# EAGLE design board (EAGLE 7.4.0)
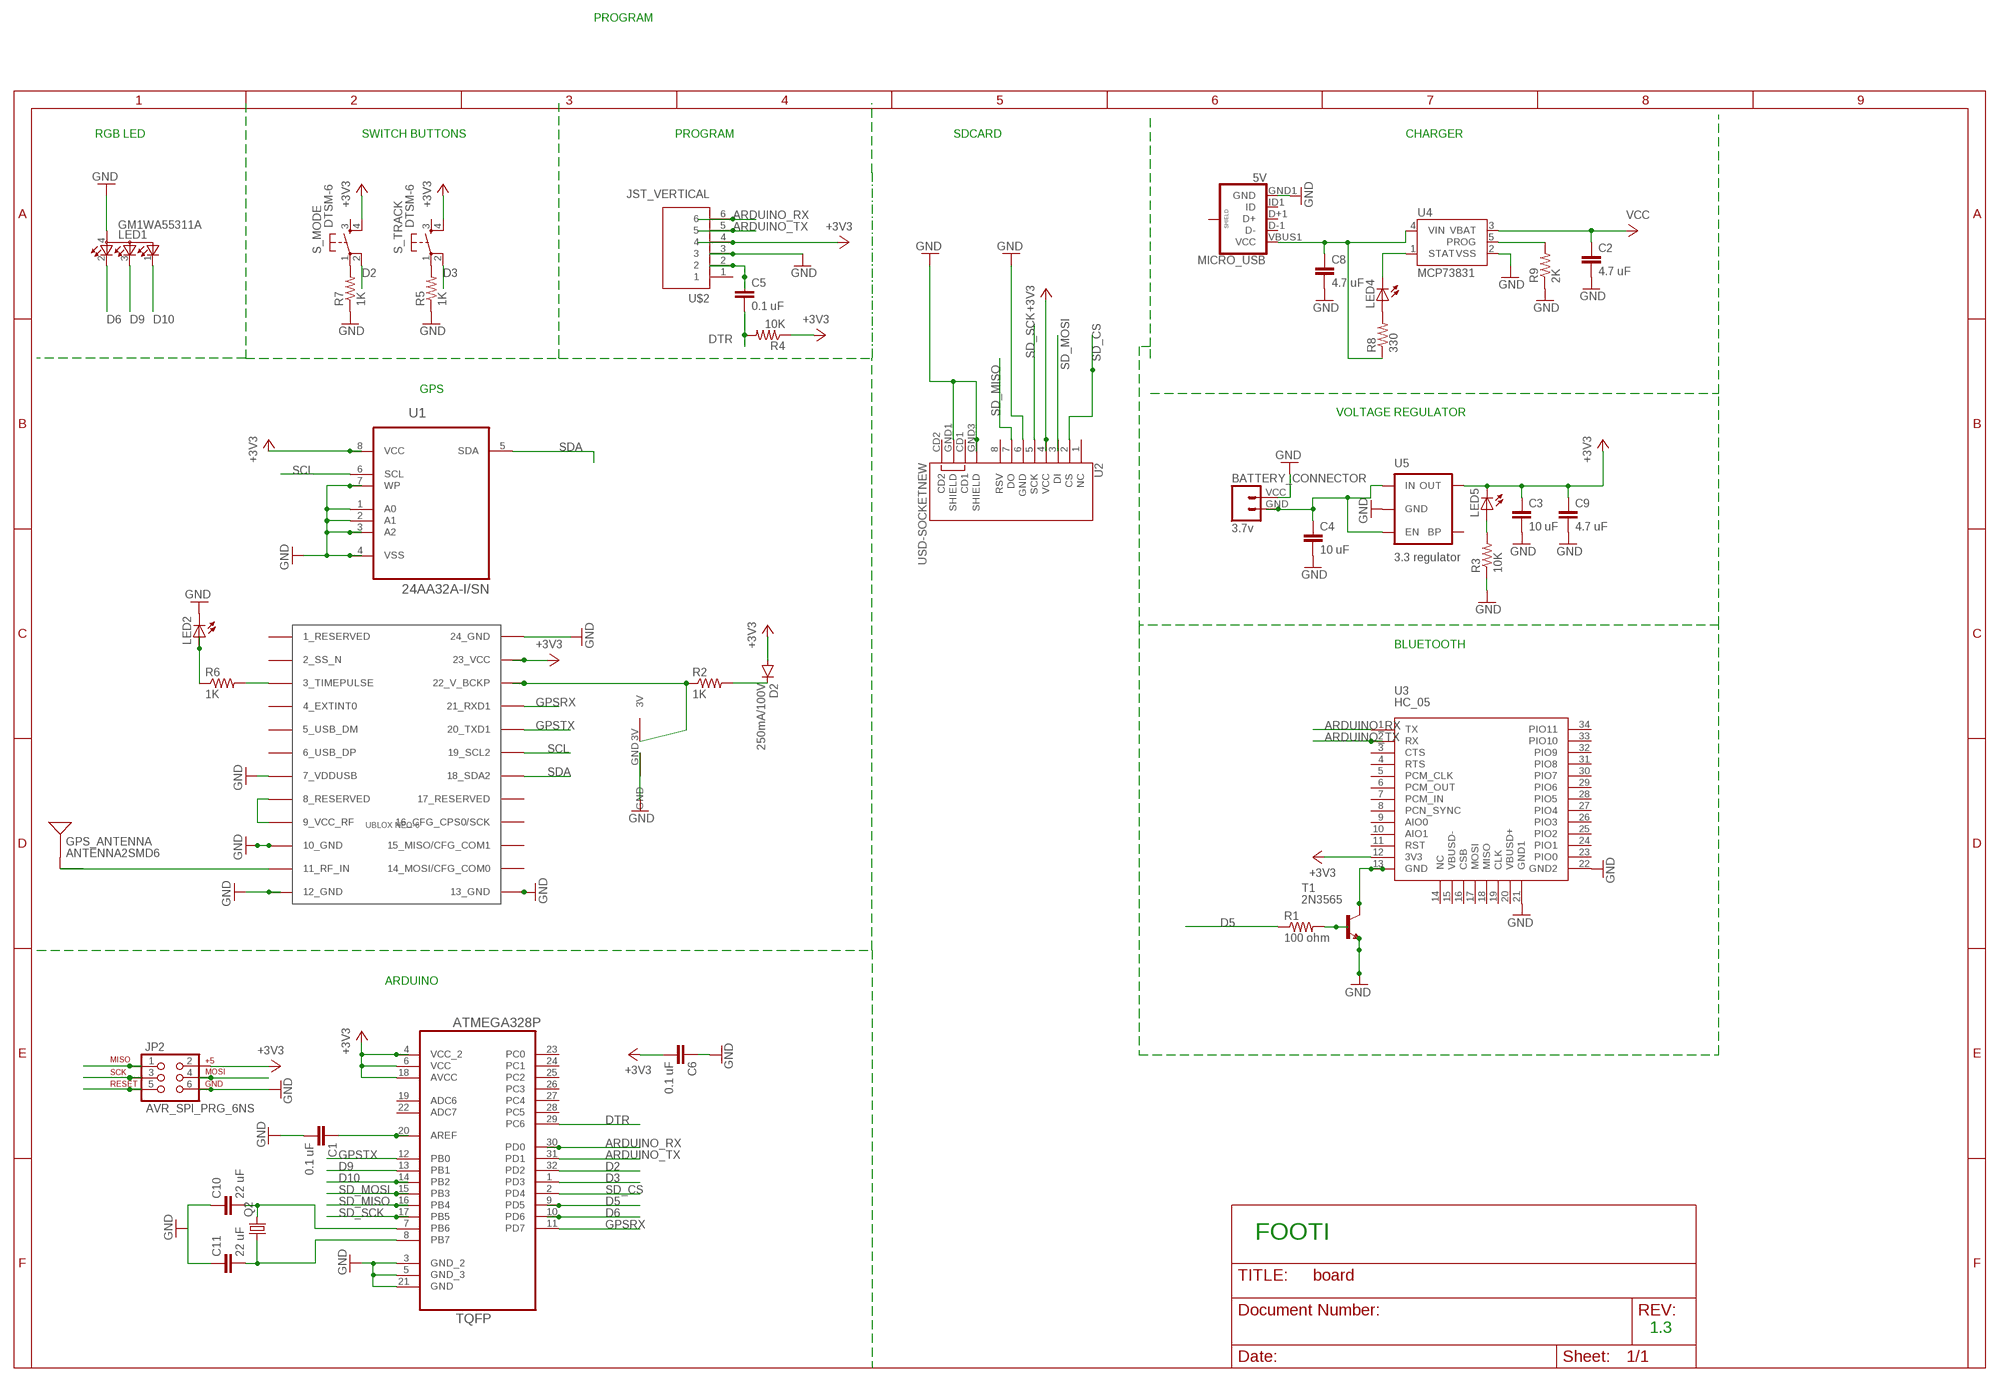
[diagram p0: schematic, sheet 1]

## Parts
BATTERY_CONNECTOR  3.7v  M024UCON-15767  [JST-2-SMD-VERT]
C1  0.1 uF  CAP1206  [1206]
C2  4.7 uF  CAP1206  [1206]
C3  10 uF  CAP1206  [1206]
C4  10 uF  CAP1206  [1206]
C5  0.1 uF  CAP1206  [1206]
C6  0.1 uF  CAP1206  [1206]
C8  4.7 uF  CAP1206  [1206]
C9  4.7 uF  CAP1206  [1206]
C10  22 uF  CAP1206  [1206]
C11  22 uF  CAP1206  [1206]
D2  250mA/100V  DIODEBAS16  [SOD-323]
GPS_ANTENNA  ANTENNA2SMD6  [ANTENNA-CHIP6]
JP2  AVR_SPI_PRG_6NS  [2X3-NS]
LED1  GM1WA55311A  [GM1WA55311A]
LED2  LED_E  [LED_1206]
LED4  LED_E  [LED_1206]
LED5  LED_E  [LED_1206]
MICRO_USB  5V  USB_MICROB_PLUGCONN-11752  [USB-B-MICRO-SMD_V03]
Q2  CRYSTALCTS406  [CTS406]
R1  100 ohm  RESISTOR1206  [1206]
R2  1K  RESISTOR1206  [1206]
R3  10K  RESISTOR1206  [1206]
R4  10K  RESISTOR1206  [1206]
R5  1K  RESISTOR1206  [1206]
R6  1K  RESISTOR1206  [1206]
R7  1K  RESISTOR1206  [1206]
R8  330  RESISTOR1206  [1206]
R9  2K  RESISTOR1206  [1206]
S_MODE  DTSM-6  [DTSM-6]
S_TRACK  DTSM-6  [DTSM-6]
T1  2N3565  [TO92]
U1  24AA32A-I/SN  [SOIC127P600X175-8N]
U2  USD-SOCKETNEW  [MICRO-SD-SOCKET-PP]
U3  HC_05  [BLUETOOTH_SMD]
U4  MCP73831  [SOT23-5]
U5  3.3 regulator  MIC52053.3V  [SOT23-5]
U6  ATMEGA328P-AU  [QFP80P900X900X120-32N]
U$1  UBLOX_NEO-6  [UBLOX_NEO-6P]
U$2  JST_VERTICAL  [JST-6-SMD-VERT-1.0MM]
U$4  VL1220/HFN  VL1220  [VL1220]

## Nets
+3V3: C3.1 C6.2 C9.1 D2.A JP2.2 LED5.C R4.1 S_MODE.4 S_TRACK.4 U1.8(VCC) U2.4(VCC) U3.12(3V3) U5.5(OUT) U6.4(VCC_2) U6.6(VCC) U6.18(AVCC) U$1.23_VCC U$2.4
ARDUINO_RX: U3.1(TX) U6.30(PD0) U$2.6
ARDUINO_TX: U3.2(RX) U6.31(PD1) U$2.5
D2: S_MODE.2 U6.32(PD2)
D3: S_TRACK.2 U6.1(PD3)
D5: R1.1 U6.9(PD5)
D6: LED1.2(CRED) U6.10(PD6)
D9: LED1.3(CBLUE) U6.13(PB1)
D10: LED1.1(CGREEN) U6.14(PB2)
DTR: C5.2 JP2.5 R4.2 U6.29(PC6)
GND [ground]: BATTERY_CONNECTOR.VCC C1.2 C2.2 C3.2 C4.2 C6.1 C8.2 C9.2 C10.1 C11.1 JP2.6 LED1.4(A) LED2.C MICRO_USB.GND1(GND) R3.1 R5.1 R7.1 R9.1 T1.3(E) U1.1(A0) U1.2(A1) U1.3(A2) U1.4(VSS) U1.7(WP) U2.6(GND) U2.GND1(SHIELD) U2.GND3(SHIELD) U3.21(GND1) U3.22(GND2) U4.2(VSS) U5.2(GND) U6.3(GND_2) U6.5(GND_3) U6.21(GND) U$1.7_VDDUSB U$1.10_GND U$1.12_GND U$1.13_GND U$1.24_GND U$2.3 U$4.GND
GPSRX: U6.11(PD7) U$1.21_RXD1
GPSTX: U6.12(PB0) U$1.20_TXD1
N$1: D2.C R2.2
N$2: C8.1 MICRO_USB.VBUS1(VCC) R8.1 U4.4(VIN)
N$3: R6.2 U$1.3_TIMEPULSE
N$4: LED2.A R6.1
N$5: U$1.8_RESERVED U$1.9_VCC_RF
N$6: R2.1 U$1.22_V_BCKP U$4.3V
N$7: GPS_ANTENNA.1(SIGNAL) U$1.11_RF_IN
N$8: LED4.A R8.2
N$9: R7.2 S_MODE.1
N$10: R5.2 S_TRACK.1
N$11: LED4.C U4.1(STAT)
N$13: C5.1 U$2.2
N$15: R9.2 U4.5(PROG)
N$16: LED5.A R3.2
N$19: R1.2 T1.2(B)
N$20: T1.1(C) U3.13(GND)
N$22: C1.1 U6.20(AREF)
N$27: C11.2 Q2.1 U6.8(PB7)
N$29: C10.2 Q2.3 U6.7(PB6)
SCL: U1.6(SCL) U$1.19_SCL2
SD_CS: U2.2(CS) U6.2(PD4)
SD_MISO: JP2.1 U2.7(DO) U6.16(PB4)
SD_MOSI: JP2.4 U2.3(DI) U6.15(PB3)
SD_SCK: JP2.3 U2.5(SCK) U6.17(PB5)
SDA: U1.5(SDA) U$1.18_SDA2
VCC: BATTERY_CONNECTOR.GND C2.1 C4.1 U4.3(VBAT) U5.1(IN) U5.3(EN)
Unconnected: MICRO_USB.D+1(D+) MICRO_USB.D-1(D-) MICRO_USB.ID1(ID) MICRO_USB.SHIELD1(SHIELD) MICRO_USB.SHIELD2(SHIELD) MICRO_USB.SHIELD3(SHIELD) S_MODE.3 S_TRACK.3 U2.1(NC) U2.8(RSV) U2.CD1 U2.CD2 U3.3(CTS) U3.4(RTS) U3.5(PCM_CLK) U3.6(PCM_OUT) U3.7(PCM_IN) U3.8(PCN_SYNC) U3.9(AIO0) U3.10(AIO1) U3.11(RST) U3.14(NC) U3.15(VBUSD-) U3.16(CSB) U3.17(MOSI) U3.18(MISO) U3.19(CLK) U3.20(VBUSD+) U3.23(PIO0) U3.24(PIO1) U3.25(PIO2) U3.26(PIO3) U3.27(PIO4) U3.28(PIO5) U3.29(PIO6) U3.30(PIO7) U3.31(PIO8) U3.32(PIO9) U3.33(PIO10) U3.34(PIO11) U5.4(BP) U6.19(ADC6) U6.22(ADC7) U6.23(PC0) U6.24(PC1) U6.25(PC2) U6.26(PC3) U6.27(PC4) U6.28(PC5) U$1.1_RESERVED U$1.2_SS_N U$1.4_EXTINT0 U$1.5_USB_DM U$1.6_USB_DP U$1.14_MOSI/CFG_COM0 U$1.15_MISO/CFG_COM1 U$1.16_CFG_CPS0/SCK U$1.17_RESERVED U$2.1

## Notes on the sheet
- PROGRAM
- RGB LED | SWITCH BUTTONS | PROGRAM | SDCARD | CHARGER
- GPS
- VOLTAGE REGULATOR
- BLUETOOTH
- ARDUINO
- FOOTI
- 1.3

## Library data of the parts
BATTERY_CONNECTOR = SparkFun-Connectors:M02: Standard 2-pin 0.1" header. Use with - straight break away headers ( PRT-00116) - right angle break away headers (PRT-00553) - swiss pins (PRT-00743) - machine pins (PRT-00117) - female headers (PRT-00115) Molex polarized connector foot print use with: PRT-08233 with associated crimp pins and housings. 2.54_SCREWTERM for use with PRT-10571. 3.5mm Screw Terminal footprints for PRT-08084 5mm Screw Terminal footprints for use with PRT-08432
C1-C6 C8-C11 = SparkFun-Capacitors:CAP: Capacitor Standard 0603 ceramic capacitor, and 0.1" leaded capacitor.
D2 = SparkFun-DiscreteSemi:DIODE: Diode These are standard reverse protection diodes and small signal diodes. SMA package can handle up to about 1A. SOD-323 can handle about 200mA. What the SOD-323 package when ordering, there are some mfgs out there that are 5-pin packages.; PROD_ID: DIO-09646
GPS_ANTENNA = SparkFun-RF:ANTENNA2: Chip antenna Single endded antenna. Common with smaller chip antennas. CHIP4 package is the GPS Chip Antenna SKU: GPS-08418. CHIP5 package is 2.4GHz chip antenna SKU: WRL-00144.
JP2 = SparkFun-Connectors:AVR_SPI_PRG_6: AVR ISP 6 Pin This is the reduced ISP connector for AVR programming. Common on Arduino. This footprint will take up less PCB space and can be used with a 10-pin to 6-pin adapter such as SKU: BOB-08508 **Special note about "TEST_POINT" package. The stop mask is on the top side, so if you want your programming test points to be on the bottom of your board, make sure to place this package on the bottom side of the board. This also ensure that the orientation to program from the bottom side will be correct.
LED1 = led:GM1WA55311A: Chip LED RGB Source: http://document.sharpsma.com/files/GM1WA55311A_SS.pdf
LED2 LED4 LED5 = eagle-ltspice:LED_E: LED Source: http://www.osram.convergy.de Source: www.luxeon.com Source: www.kingbright.com; SPICEMODEL: NONE; SPICEPREFIX: D; SPICETYPE: diode
MICRO_USB = SparkFun-Connectors:USB_MICROB_PLUG: USB Micro-B connectors Some male, some female. Watch your step!; PROD_ID: CONN-11752
Q2 = crystal:CRYSTAL: CRYSTAL; OC_FARNELL: unknown; OC_NEWARK: unknown
R1-R9 = SparkFun-Passives:RESISTOR: Resistor Basic schematic elements and footprints for 0603, 1206, and PTH resistors.
S_MODE S_TRACK = switch-tact:DTSM-6; OC_FARNELL: unknown
T1 = transistor:2N3565: NPN TRANSISTOR
U1 = footie:24AA32A-I/SN: IC EEPROM 32KBIT 400KHZ ,SOIC-8; MPN: 24AA32A-I/SN; OC_FARNELL: 1617659; OC_NEWARK: 83C5815; PACKAGE: SOIC-8; SUPPLIER: Microchip
U2 = SparkFun-Connectors:USD-SOCKET: microSD Socket Push-push type uSD socket. Schematic element and footprint production proven. Spark Fun Electronics SKU : PRT-00127. tDoc lines correctly indicate media card edge positions when inserting (unlocked, locked, depressed). NOTE: CD1 and CD2 are connected internally; PROD_ID: CONN-07820
U3 = SerialPortBluetooth:HC_05
U4 = SparkFun-PowerIC:MCP73831: Miniature single cell, fully integrated Li-Ion, Li-polymer charge management controller http://ww1.microchip.com/downloads/en/DeviceDoc/20001984g.pdf IC-09995; PROD_ID: IC-09995
U5 = SparkFun-PowerIC:MIC5205: MIC5205 150mA vreg 3.3V - VREG-00822 5V - VREG-00823; PROD_ID: VREG-00822
U6 = Ava:ATMEGA328P-AU; DESCRIPTION: 8-bit Microcontroller with In-System Programmable Flash; MPN: ATMEGA328P-AU; OC_FARNELL: 1715486; OC_NEWARK: 14R4631; PACKAGE: TQFP-32; SUPPLIER: Atmel
U$1 = Ava:UBLOX_NEO-6: UBLOX NEO-6 GPS MODULE Author Anthony Stirk / http://ava.upuaut.net http://www.u-blox.com/images/downloads/Product_Docs/LEA-6_NEO-6_MAX_HardwareIntegrationManual_%28GPS.G6-HW-09007%29.pdf http://www.u-blox.com/images/downloads/Product_Docs/NEO-6_DataSheet_%28GPS.G6-HW-09005%29.pdf
U$2 = SparkFun-Connectors:JST_VERTICAL; PROD_ID: CONN-08249
U$4 = footie:VL1220

## Net classes
1 ground: width 0.508 mm

## Board
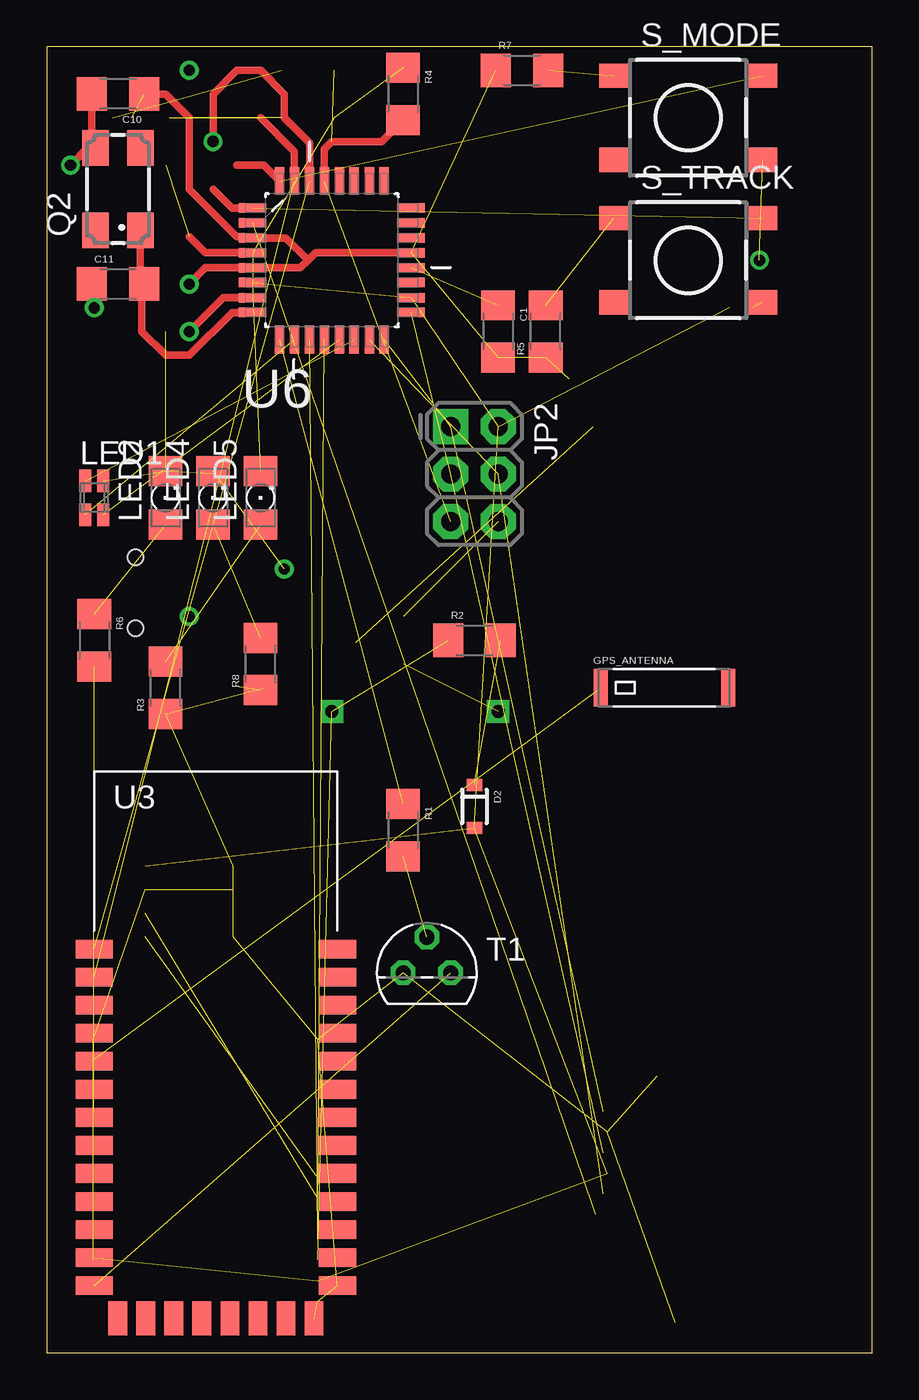
[diagram p1: board, top side]
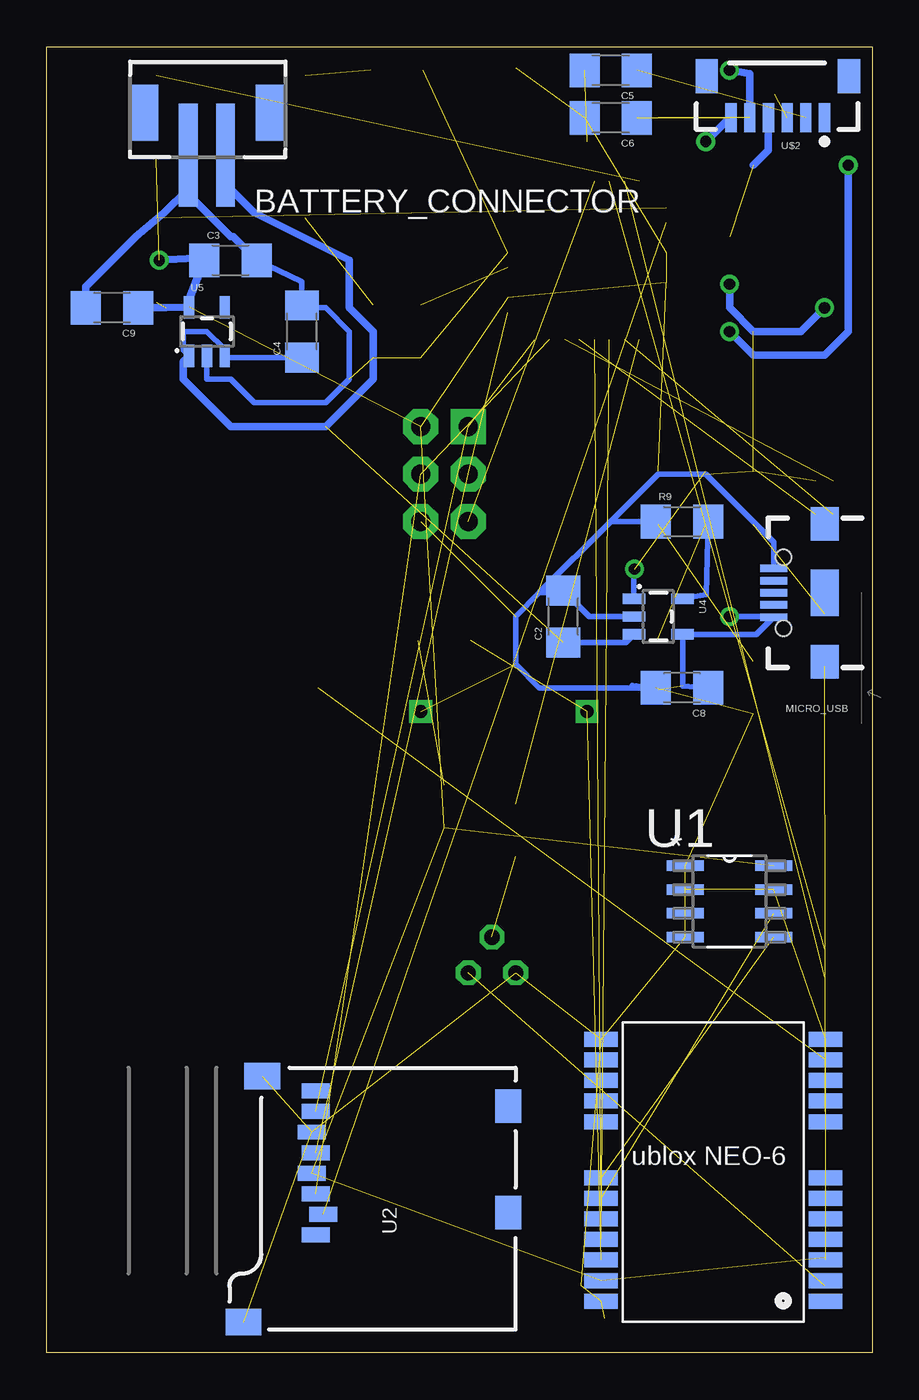
[diagram p2: board, bottom side, seen from below]

Size 44.12 x 69.84 mm. Coordinates in mm from the lower left corner, seen from the top.
Outline: 0,0 44.12,0 44.12,69.84 0,69.84 0,0
Copper layers (1*16): Top 0.035mm / dielectric 1.5mm / Bottom 0.035mm
Design rules "default": minimum track width 10mil, minimum drill 24mil, track to track 8mil, track to pad 8mil, pad to pad 8mil, via to via 8mil, smd to smd 8mil, copper to edge 40mil, drill to drill 8mil, minimum pad ring 10mil, minimum via ring 8mil, stop-mask expansion 4mil, vias tented up to drill 0mil, thermal gap 10mil

### Footprints (pad centres in the part's own frame; a part is rotated, then mirrored left to right if it is on the bottom)
JST-2-SMD-VERT = smd 1 x 5.5: GND 1,-2; VCC -1,-2 | smd 1.6 x 3: P$1 -3.4,0.27; P$2 3.4,0.27
1206 = smd 1.6 x 1.8: 1 -1.4,0; 2 1.4,0
SOD-323 = smd 0.63 x 0.83: A 1.15,0; C -1.15,0
ANTENNA-CHIP6 = smd 0.75 x 2: 1 -3.4,0; NC 3.4,0
2X3-NS = drill 1.016 pad 1.88 square: 1 -2.54,-1.27 | drill 1.016 pad 1.88 octagon: 2 -2.54,1.27; 3 0,-1.27; 4 0,1.27; 5 2.54,-1.27; 6 2.54,1.27
GM1WA55311A = smd 0.65 x 1.2: 1 -0.475,0.9; 2 -0.475,-0.9; 3 0.475,-0.9; 4 0.475,0.9
LED_1206 = smd 1.6 x 1.803: A -1.422,0; C 1.422,0
USB-B-MICRO-SMD_V03 = smd 1.45 x 0.4: D+1 2.725,0; D-1 2.725,0.65; GND1 2.725,-1.3; ID1 2.725,-0.65; VBUS1 2.725,1.3 | smd 1.5 x 1.8: SHIELD1 0,3.685; SHIELD2 0,-3.685 | smd 1.5 x 2.5: SHIELD3 0,0 | hole 0.85: 2.2,1.9; 2.2,-1.9
CTS406 = smd 1.9 x 1.4: 1 -2.2,-1.2; 2 2.2,-1.2; 3 2.2,1.2; 4 -2.2,1.2
DTSM-6 = smd 1.55 x 1.3: 1 -3.975,2.25; 2 3.975,2.25; 3 -3.975,-2.25; 4 3.975,-2.25
TO92 = drill 0.813 octagon: 1 1.27,0; 2 0,1.905; 3 -1.27,0
SOIC127P600X175-8N = smd 1.981 x 0.559: 1 -2.362,1.905; 2 -2.362,0.635; 3 -2.362,-0.635; 4 -2.362,-1.905; 5 2.362,-1.905; 6 2.362,-0.635; 7 2.362,0.635; 8 2.362,1.905
MICRO-SD-SOCKET-PP = smd 0.8 x 1.5: 1 -8.94,10.7; 2 -7.84,10.3; 3 -6.74,10.7; 4 -5.64,10.9; 5 -4.54,10.7; 6 -3.44,10.9; 7 -2.34,10.7; 8 -1.24,10.7 | smd 1.8 x 1.4: CD1 -2.05,0.4; CD2 -7.75,0.4 | smd 1.4 x 1.9: GND1 -13.6,14.55; GND3 -0.45,13.55
BLUETOOTH_SMD = smd 2 x 1: 1 0,0; 2 0,-1.5; 3 0,-3; 4 0,-4.5; 5 0,-6; 6 0,-7.5; 7 0,-9; 8 0,-10.5; 9 0,-12; 10 0,-13.5; 11 0,-15; 12 0,-16.5; 13 0,-18; 22 13,-18; 23 13,-16.5; 24 13,-15; 25 13,-13.5; 26 13,-12; 27 13,-10.5; 28 13,-9; 29 13,-7.5; 30 13,-6; 31 13,-4.5; 32 13,-3; 33 13,-1.5; 34 13,0 | smd 1 x 1.8: 14 1.25,-19.75; 15 2.75,-19.75; 16 4.25,-19.75; 17 5.75,-19.75; 18 7.25,-19.75; 19 8.75,-19.75; 20 10.25,-19.75; 21 11.75,-19.75
SOT23-5 = smd 0.55 x 1.2: 1 -0.95,-1.3; 2 0,-1.3; 3 0.95,-1.3; 4 0.95,1.3; 5 -0.95,1.3
QFP80P900X900X120-32N = smd 1.473 x 0.508: 1 -4.242,2.794; 2 -4.242,2.007; 3 -4.242,1.194; 4 -4.242,0.406; 5 -4.242,-0.406; 6 -4.242,-1.194; 7 -4.242,-2.007; 8 -4.242,-2.794; 17 4.242,-2.794; 18 4.242,-2.007; 19 4.242,-1.194; 20 4.242,-0.406; 21 4.242,0.406; 22 4.242,1.194; 23 4.242,2.007; 24 4.242,2.794 | smd 0.508 x 1.473: 9 -2.794,-4.242; 10 -2.007,-4.242; 11 -1.194,-4.242; 12 -0.406,-4.242; 13 0.406,-4.242; 14 1.194,-4.242; 15 2.007,-4.242; 16 2.794,-4.242; 25 2.794,4.242; 26 2.007,4.242; 27 1.194,4.242; 28 0.406,4.242; 29 -0.406,4.242; 30 -1.194,4.242; 31 -2.007,4.242; 32 -2.794,4.242
UBLOX_NEO-6P = smd 1.8 x 0.8: 1_RESERVED 6.4,-7.4; 2_SS_N 6.4,-6.3; 3_TIMEPULSE 6.4,-5.2; 4_EXTINT0 6.4,-4.1; 5_USB_DM 6.4,-3; 6_USB_DP 6.4,-1.9; 7_VDDUSB 6.4,-0.8; 8_RESERVED 6.4,2.2; 9_VCC_RF 6.4,3.3; 10_GND 6.4,4.4; 11_RF_IN 6.4,5.5; 12_GND 6.4,6.6; 13_GND -5.6,6.6; 14_MOSI/CFG_COM0 -5.6,5.5; 15_MISO/CFG_COM1 -5.6,4.4; 16_CFG_CPS0/SCK -5.6,3.3; 17_RESERVED -5.6,2.2; 18_SDA2 -5.6,-0.8; 19_SCL2 -5.6,-1.9; 20_TXD1 -5.6,-3; 21_RXD1 -5.6,-4.1; 22_V_BCKP -5.6,-5.2; 23_VCC -5.6,-6.3; 24_GND -5.6,-7.4
JST-6-SMD-VERT-1.0MM = smd 0.6 x 1.55: 1 -2.54,1.27; 2 -1.54,1.27; 3 -0.54,1.27; 4 0.46,1.27; 5 1.46,1.27; 6 2.46,1.27 | smd 1.2 x 1.8: P$1 -3.84,-0.955; P$2 3.76,-0.955
VL1220 = drill 0.7 pad 0.75 square: 3V 0,0; GND 8.89,0

### Placement (x,y rotation side)
BATTERY_CONNECTOR  35.56,66.04 0 bottom
C1  24.13,54.61 270 top
C2  16.51,39.37 90 bottom
C3  34.29,58.42 0 bottom
C4  30.48,54.61 90 bottom
C5  13.97,68.58 180 bottom
C6  13.97,66.04 180 bottom
C8  10.16,35.56 180 bottom
C9  40.64,55.88 180 bottom
C10  3.81,67.31 180 top
C11  3.81,57.15 0 top
D2  22.86,29.21 270 top
GPS_ANTENNA  33.02,35.56 0 top
JP2  22.86,46.99 270 top
LED1  2.54,45.72 0 top
LED2  6.35,45.72 90 top
LED4  8.89,45.72 90 top
LED5  11.43,45.72 90 top
MICRO_USB  2.54,40.64 180 bottom
Q2  3.81,62.23 90 top
R1  19.05,27.94 270 top
R2  22.86,38.1 0 top
R3  6.35,35.56 90 top
R4  19.05,67.31 270 top
R5  26.67,54.61 90 top
R6  2.54,38.1 270 top
R7  25.4,68.58 0 top
R8  11.43,36.83 90 top
R9  10.16,44.45 0 bottom
S_MODE  34.29,66.04 0 top
S_TRACK  34.29,58.42 0 top
T1  20.32,20.32 0 top
U1  7.62,24.13 0 bottom
U2  19.05,15.24 90 bottom
U3  2.54,21.59 0 top
U4  11.43,39.37 270 bottom
U5  35.56,54.61 0 bottom
U6  15.24,58.42 0 top
U$1  8.89,10.16 0 bottom
U$2  5.08,67.31 180 bottom
U$4  15.24,34.29 0 top

### Tracks (layer width: path | path; a pad name or v marks a point on that pad's centre or on a via)
+3V3  (via drill 0.6)  (15 unrouted)
  Top 0.406: U6.4 8.48,58.83 7.62,59.69
  Bottom 0.406: C9.1 37.75,55.88 U5.5 36.51,56.33 C3.1 35.69,58.55 v38.1,58.42 | U$2.4 5.54,64.31 6.35,63.5
ARDUINO_RX  (via drill 0.6)  (1 unrouted)
  Top 0.406: U6.30 14.05,64.69 12.7,66.04 12.7,67.31 11.43,68.58 10.16,68.58 8.89,67.31 v8.89,64.77
  Bottom 0.406: U$2.6 7.62,66.04 v8.89,64.77
ARDUINO_TX  (via drill 0.6)  (2 unrouted)
  Top 0.406: U6.31 13.23,64.24 11.43,66.04
  Bottom 0.406: U$2.5 6.54,68.39 v7.62,68.58
D2  (1 unrouted)
  Top 0.406: U6.32 11.61,63.5 10.16,63.5
D3  (1 unrouted)
  Top 0.406: U6.1 9.91,61.21 8.89,62.23
D5  (1 unrouted)
D6  (1 unrouted)
D9  (1 unrouted)
D10  (1 unrouted)
DTR  (2 unrouted)
  Top 0.406: U6.29 14.83,64.36 15.24,64.77 17.91,64.77 R4.2
GND  (via drill 0.6)  (28 unrouted)
  Top 0.406: 13.97,58.42 12.78,59.61 U6.3 10.92,59.69 10.16,59.69 7.62,62.23 7.62,66.04 6.35,67.31 C10.1 | 13.97,58.42 13.56,58.01 U6.5 8.48,58.01 v7.62,57.15 | C11.1 2.41,56.01 v2.54,55.88 2.54,57.15 | U6.21 14.38,58.83 13.97,58.42
  Bottom 0.305: 12.83,35.69 C8.2 17.78,35.56 19.05,36.83 19.05,39.37 17.78,40.64 | 17.78,40.64 16.64,40.64 C2.2 15.11,39.37 U4.2 | R9.1 13.97,44.45 | 13.97,44.45 17.78,40.64 | MICRO_USB.GND1 5.26,43.37 8.89,46.99 11.43,46.99 13.97,44.45 | U5.2 35.56,52.07 34.29,52.07 33.02,50.8 29.21,50.8 27.94,52.07 27.94,54.61 29.21,55.88 30.35,55.88 C4.2 30.48,57.28 C3.2
  Bottom 0.406: BATTERY_CONNECTOR.VCC 36.56,62.23 | 36.56,62.23 36.56,61.96 34.29,59.69 34.16,59.69 C3.2 | C9.2 42.04,57.02 39.37,59.69 37.83,60.96 36.56,62.23 | v7.62,57.15 7.62,55.88 6.35,54.61 3.81,54.61 v2.54,55.88
GPSRX  (1 unrouted)
GPSTX  (1 unrouted)
N$1  (1 unrouted)
N$2  (1 unrouted)
  Bottom 0.305: C8.1 10.13,35.66 U4.4 6.18,38.42 MICRO_USB.VBUS1
N$3  (1 unrouted)
N$4  (1 unrouted)
N$5  (1 unrouted)
N$6  (2 unrouted)
N$7  (1 unrouted)
N$8  (1 unrouted)
N$9  (1 unrouted)
N$10  (1 unrouted)
N$11  (via drill 0.6)  (1 unrouted)
  Bottom 0.305: U4.1 12.73,41.88 v12.7,41.91
N$13  (1 unrouted)
N$15
  Bottom 0.305: U4.5 8.86,40.54 R9.2
N$16  (1 unrouted)
N$17  (via drill 0.6)
  Bottom 0.305: 5.08,39.37 v7.62,39.37
N$19  (1 unrouted)
N$20  (1 unrouted)
N$22  (1 unrouted)
N$27
  Top 0.406: U6.8 9.91,55.63 7.62,53.34 6.35,53.34 5.08,54.61 5.08,57.02 C11.2 5.01,57.35 Q2.1
N$29  (via drill 0.6)
  Top 0.406: U6.7 9.42,56.41 v7.62,54.61 | C10.2 2.41,64.63 Q2.3 2.2,64.43 v1.27,63.5
  Bottom 0.406: v1.27,63.5 1.27,54.61 2.54,53.34 6.35,53.34 v7.62,54.61
SCL  (1 unrouted)
SD_CS  (1 unrouted)
SD_MISO  (2 unrouted)
SD_MOSI  (2 unrouted)
SD_SCK  (2 unrouted)
SDA  (1 unrouted)
VCC  (1 unrouted)
  Bottom 0.305: C2.1 13.18,37.97 U4.3 | U5.1 36.83,53.63 36.83,54.61 35.56,54.61 34.61,53.66 U5.3 34.51,53.21 C4.1
  Bottom 0.406: BATTERY_CONNECTOR.GND 34.56,62.5 33.02,60.96 27.94,58.42 27.94,55.88 26.67,54.61 26.67,52.07 29.21,49.53 34.29,49.53 36.83,52.07 36.83,52.99 U5.1